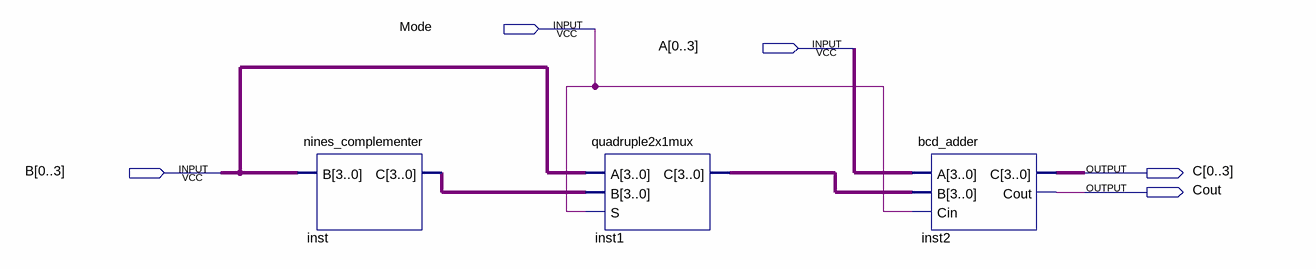
[diagram p0: schematic sheet]
// Quartus schematic finalDesign.bdf as structural Verilog: 3 symbols, 5 pins
module finalDesign (
  input  Mode,
  input  [0:3] A,
  input  [0:3] B,
  output [0:3] C,
  output Cout
);

  wire [3:0] inst1_c, inst_c;

  nines_complementer inst (.B(B), .C(inst_c));
  quadruple2x1mux inst1 (.A(B), .B(inst_c), .S(Mode), .C(inst1_c));
  bcd_adder inst2 (.A(A), .B(inst1_c), .Cin(Mode), .C(C), .Cout(Cout));
endmodule
